# EAGLE design Mailchecker2 (EAGLE 6.1)
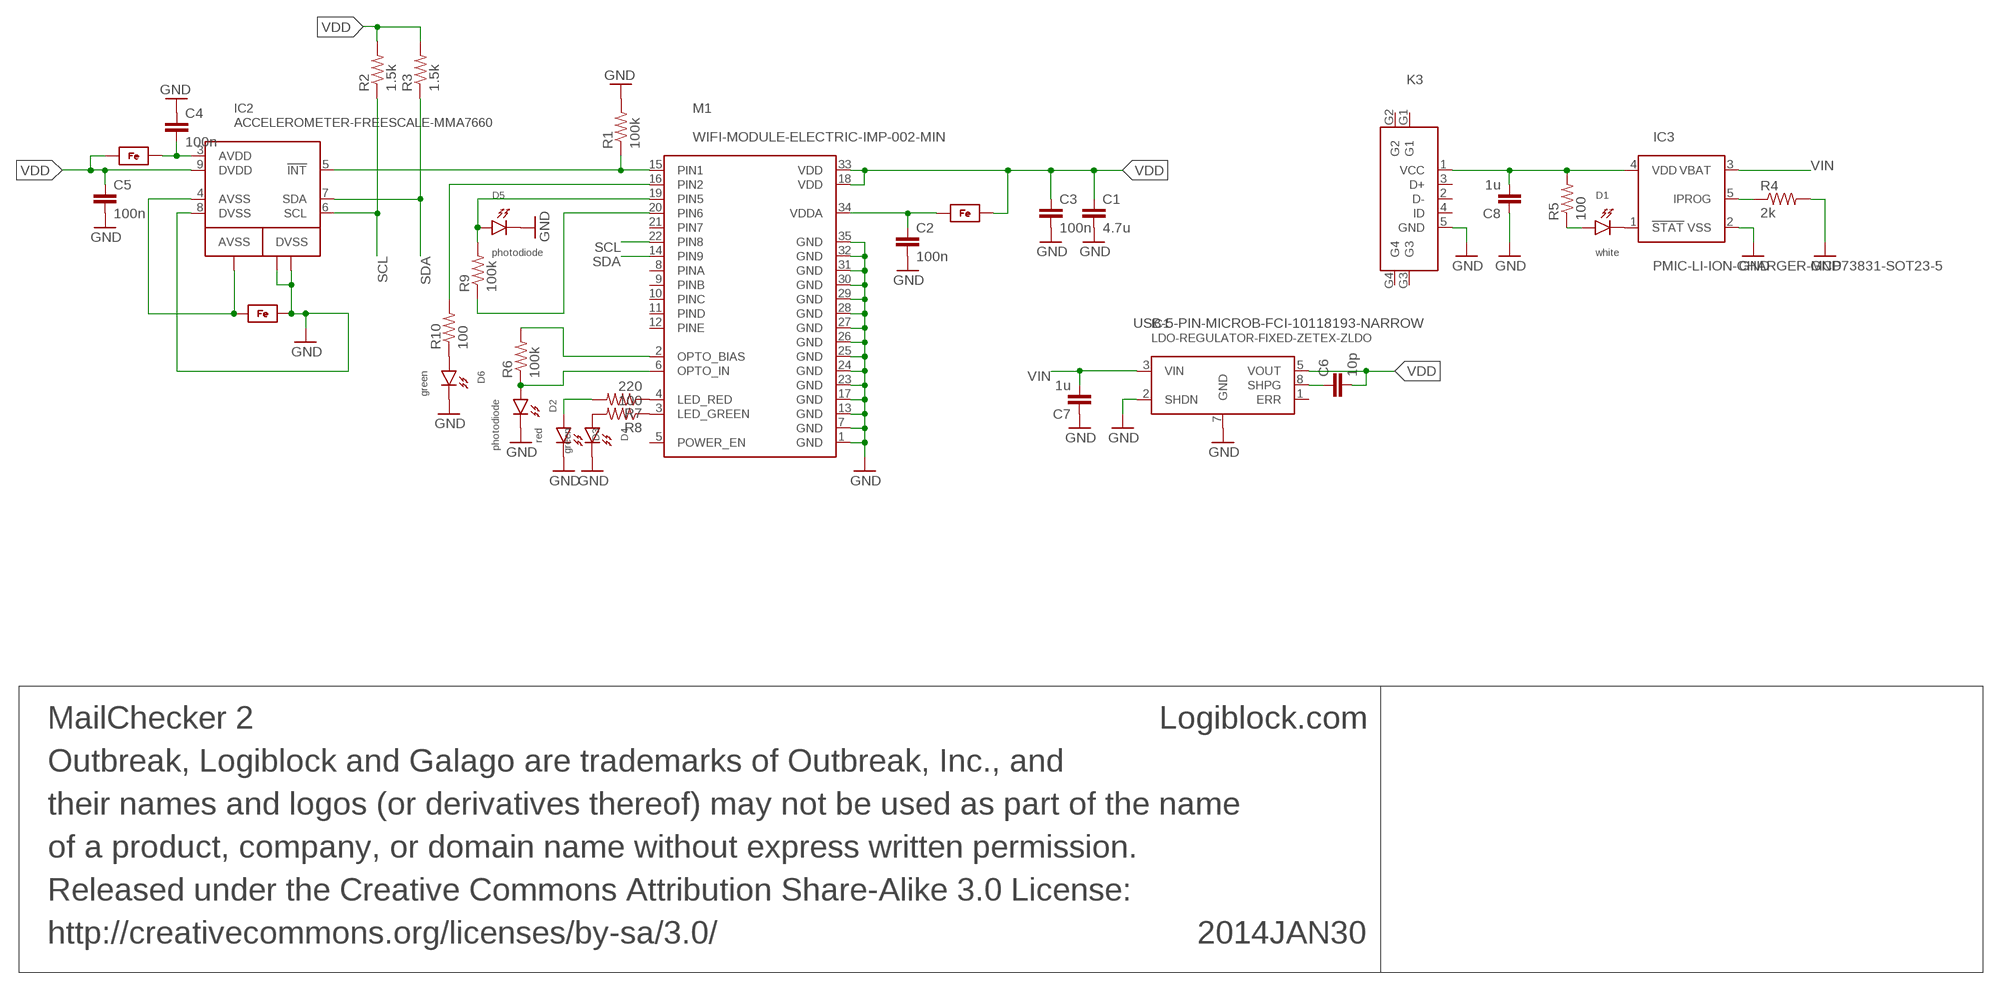
[diagram p0: schematic, sheet 1]

## Parts
2014JAN30  MailChecker 2  INFO-BLOCK  [INFO-BLOCK]
C1  4.7u  CAP-0805-MIN  [0805-MIN]
C2  100n  CAP-0402-MIN  [0402-MIN]
C3  100n  CAP-0402-MIN  [0402-MIN]
C4  100n  CAP-0402-MIN  [0402-MIN]
C5  100n  CAP-0402-MIN  [0402-MIN]
C6  10p  CAP-0402-MIN  [0402-MIN]
C7  1u  CAP-0603-MIN  [0603-MIN]
C8  1u  CAP-0603-MIN  [0603-MIN]
D1  white  LED-0603-MIN  [0603-DIODE-MIN]
D2  photodiode  LED-0603-MIN  [0603-DIODE-MIN]
D3  red  LED-0603-MIN  [0603-DIODE-MIN]
D4  green  LED-0603-MIN  [0603-DIODE-MIN]
D5  photodiode  LED-0603-MIN  [0603-DIODE-MIN]
D6  green  LED-0603-MIN  [0603-DIODE-MIN]
FB1  FERRITE-BEAD-0603-MIN  [0603-MIN]
FB2  FERRITE-BEAD-0603-MIN  [0603-MIN]
FB3  FERRITE-BEAD-0603-MIN  [0603-MIN]
IC1  LDO-REGULATOR-FIXED-ZETEX-ZLDO  [SM8-ZETEX]
IC2  ACCELEROMETER-FREESCALE-MMA7660  [QFN10-3X3MM-FREESCALE-MMA7660]
IC3  PMIC-LI-ION-CHARGER-MCP73831-SOT23-5  [SOT23-5]
K3  USB-5-PIN-MICROB-FCI-10118193-NARROW  [USB-MICROB-FCI-10118193-NARROW]
M1  WIFI-MODULE-ELECTRIC-IMP-002-MIN  [ELECTRIC-IMP-002-MIN]
R1  100k  RESISTOR-0402-MIN  [0402-MIN]
R2  1.5k  RESISTOR-0402-MIN  [0402-MIN]
R3  1.5k  RESISTOR-0402-MIN  [0402-MIN]
R4  2k  RESISTOR-0402-MIN  [0402-MIN]
R5  100  RESISTOR-0402-MIN  [0402-MIN]
R6  100k  RESISTOR-0402-MIN  [0402-MIN]
R7  220  RESISTOR-0402-MIN  [0402-MIN]
R8  100  RESISTOR-0402-MIN  [0402-MIN]
R9  100k  RESISTOR-0402-MIN  [0402-MIN]
R10  100  RESISTOR-0402-MIN  [0402-MIN]

## Nets
AVDD: C4.1 FB3.2 IC2.3(AVDD)
AVSS: FB2.1 IC2.1(G3) IC2.4(AVSS)
GND: C1.1 C2.1 C3.1 C4.2 C5.1 C7.2 C8.2 D2.K D3.K D4.K D5.K D6.K FB2.2 IC1.2(SHDN) IC1.7(GND) IC2.8(DVSS) IC2.G1 IC2.G2 IC3.2(VSS) K3.5(GND) M1.1(GND) M1.7(GND) M1.13(GND) M1.17(GND) M1.23(GND) M1.24(GND) M1.25(GND) M1.26(GND) M1.27(GND) M1.28(GND) M1.29(GND) M1.30(GND) M1.31(GND) M1.32(GND) M1.35(GND) R1.2 R4.2
INT: IC2.5(!INT) M1.15(PIN1) R1.1
IPROG: IC3.5(IPROG) R4.1
N$1: M1.2(OPTO_BIAS) R6.2
N$2: M1.20(PIN6) R9.1
N$3: D1.K IC3.1(!STAT)
N$4: D1.A R5.1
N$5: D2.A M1.6(OPTO_IN) R6.1
N$6: M1.4(LED_RED) R7.1
N$7: M1.3(LED_GREEN) R8.1
N$8: D4.A R8.2
N$9: D3.A R7.2
N$10: D5.A M1.19(PIN5) R9.2
N$11: M1.16(PIN2) R10.2
N$12: D6.A R10.1
SCL: IC2.6(SCL) M1.22(PIN8) R2.1
SDA: IC2.7(SDA) M1.14(PIN9) R3.1
SHAPING: C6.2 IC1.8(SHPG)
VCHARGE: C8.1 IC3.4(VDD) K3.1(VCC) R5.2
VDD: C1.2 C3.2 C5.2 C6.1 FB1.2 FB3.1 IC1.5(VOUT) IC2.9(DVDD) M1.18(VDD) M1.33(VDD) R2.2 R3.2
VDDA: C2.2 FB1.1 M1.34(VDDA)
VIN: C7.1 IC1.3(VIN) IC3.3(VBAT)
Unconnected: IC1.1(ERR) K3.2(D-) K3.3(D+) K3.4(ID) K3.G1 K3.G2 K3.G3 K3.G4 M1.5(POWER_EN) M1.8(PINA) M1.9(PINB) M1.10(PINC) M1.11(PIND) M1.12(PINE) M1.21(PIN7)

## Library data of the parts
2014JAN30 = Outbreak:INFO-BLOCK
C1-C8 = Outbreak:CAP
D1-D6 = Outbreak:LED
FB1-FB3 = Outbreak:FERRITE-BEAD
IC1 = Outbreak:LDO-REGULATOR-FIXED-ZETEX-ZLDO: ZETEX ULTRA LOW DROPOUT REGULATOR Ultra-low-dropout linear regulator Vin = [0V, 20V], Vout = 3.3V; Vin - 100mV when 0V < Vin < 3.4V Imax = 300mA continuous The shutdown pin (2, 'SHDN') is an active-high logic-level input: 0 - regulator active 1 - shutdown If not used, tie to GND The low battery flag (1, ERR) is an open-collector NPN driver which pulls low when the voltage drop across the regulator has fallen to less than 300mV. Not useful for very-low-dropout scenarios but can provide advance warning of battery failure for e.g. LiIon-to-3.3V use cases. Leave floating if not used. Pin 4 is internally N/C and my be connected in any fashion. Pin 6 is DNC and must be left floating.
IC2 = Outbreak:ACCELEROMETER-FREESCALE-MMA7660
IC3 = Outbreak:PMIC-LI-ION-CHARGER-MCP73831
K3 = Outbreak:USB-5-PIN
M1 = Outbreak:WIFI-MODULE-ELECTRIC-IMP-002
R1-R10 = Outbreak:RESISTOR: Resistor Basic schematic elements and footprints for 0603, 1206, and PTH resistors.

## Board
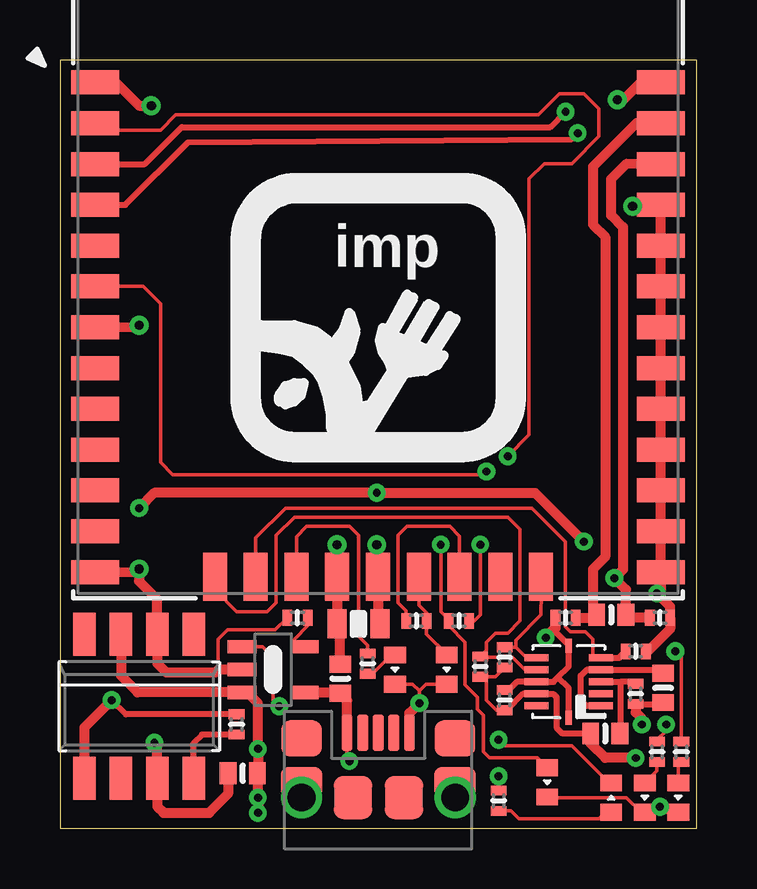
[diagram p1: board, top side]
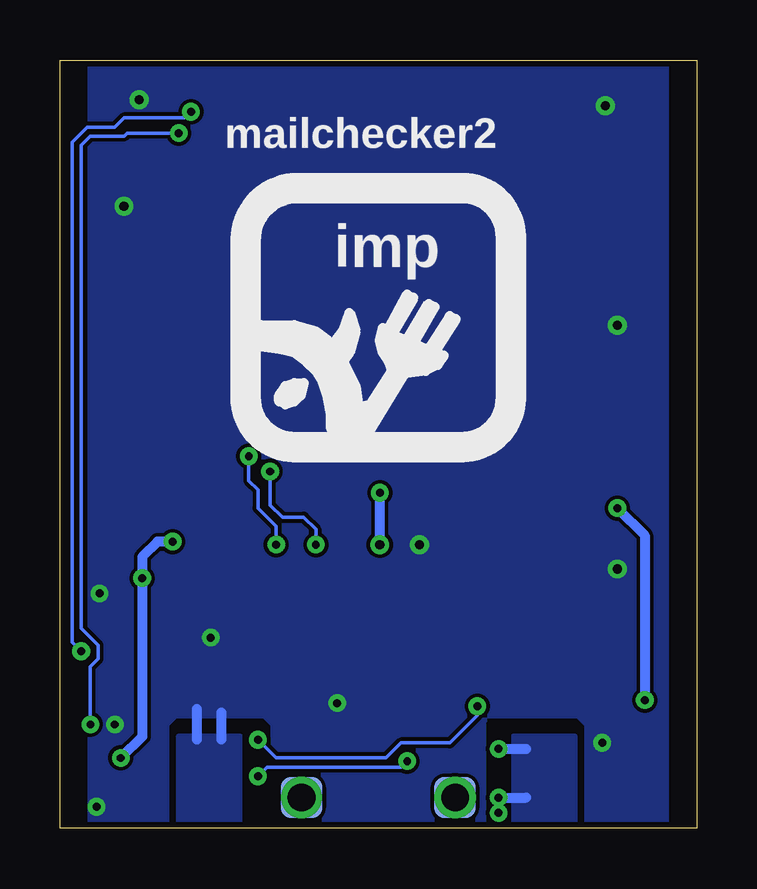
[diagram p2: board, bottom side, seen from below]

Size 26.54 x 32 mm. Coordinates in mm from the lower left corner, seen from the top.
Outline: 0,0 26.54,0 26.54,32 0,32 0,0
Copper layers (1*16): Top 0.035mm / dielectric 1.5mm / Bottom 0.035mm
Design rules: minimum track width 6mil, minimum drill 13mil, track to track 6mil, track to pad 6mil, pad to pad 6mil, via to via 6mil, smd to smd 6mil, copper to edge 10mil, drill to drill 8mil, minimum pad ring 10mil, minimum via ring 8mil, stop-mask expansion 4mil, vias tented up to drill 20mil, thermal gap 10mil

### Footprints (pad centres in the part's own frame; a part is rotated, then mirrored left to right if it is on the bottom)
0805-MIN = smd 0.8 x 1.2: 1 -0.9,0; 2 0.9,0
0402-MIN = smd 0.4 x 0.65: 1 -0.425,0; 2 0.425,0
0603-MIN = smd 0.7 x 0.9: 1 -0.61,0; 2 0.61,0
0603-DIODE-MIN = smd 0.7 x 0.9: A -0.61,0; K 0.61,0
SM8-ZETEX = smd 0.95 x 1.8: 1 2.28,3; 2 0.76,3; 3 -0.76,3; 4 -2.28,3; 5 -2.28,-3; 6 -0.76,-3; 7 0.76,-3; 8 2.28,-3
QFN10-3X3MM-FREESCALE-MMA7660 = smd 0.29 x 1: 1 1,1.35; 2 0.5,1.35; 3 0,1.35; 4 -0.5,1.35; 5 -1,1.35; 6 -1,-1.35; 7 -0.5,-1.35; 8 0,-1.35; 9 0.5,-1.35; 10 1,-1.35 | smd 0.6 x 0.29: G1 -1.5,0; G2 1.5,0
SOT23-5 = smd 0.55 x 1.2: 1 0.95,1.3; 2 0,1.3; 3 -0.95,1.3; 4 -0.95,-1.3; 5 0.95,-1.3
USB-MICROB-FCI-10118193-NARROW = smd 0.44 x 1.5: 1 -1.3,2.7; 2 -0.65,2.7; 3 0,2.7; 4 0.65,2.7; 5 1.3,2.7 | smd 1.7 x 1.5: G1 -3.2,2.473; G4 3.2,2.473 | smd 1.6 x 1.8: G2 -1.055,0; G3 1.075,0 | smd 1.72 x 1.72 bottom: G5 -3.2,0; G7 3.2,0 | smd 1.72 x 1.3: G6 -3.2,0.635; G8 3.2,0.635 | drill 1.15 pad 1.7: P$1 -3.2,0; P$2 3.2,0
ELECTRIC-IMP-002-MIN = smd 2 x 1: 1 0.7,21.29; 2 0.7,19.59; 3 0.7,17.89; 4 0.7,16.19; 5 0.7,14.49; 6 0.7,12.79; 7 0.7,11.09; 8 0.7,9.39; 9 0.7,7.69; 10 0.7,5.99; 11 0.7,4.29; 12 0.7,2.59; 13 0.7,0.89; 23 24.3,0.89; 24 24.3,2.59; 25 24.3,4.29; 26 24.3,5.99; 27 24.3,7.69; 28 24.3,9.39; 29 24.3,11.09; 30 24.3,12.79; 31 24.3,14.49; 32 24.3,16.19; 33 24.3,17.89; 34 24.3,19.59; 35 24.3,21.29 | smd 1 x 2: 14 5.7,0.69; 15 7.4,0.69; 16 9.1,0.69; 17 10.8,0.69; 18 12.5,0.69; 19 14.2,0.69; 20 15.9,0.69; 21 17.6,0.69; 22 19.3,0.69

### Placement (x,y rotation side)
2014JAN30  -7.62,-17.78 0 top  (outside the outline)
C1  12.45,8.51 0 top
C2  21.08,8.76 0 top
C3  25.02,8.76 180 top
C4  24,5.59 270 top
C5  18.54,5.33 270 top
C6  7.37,4.32 270 top
C7  7.62,2.29 180 top
C8  11.68,6.22 90 top
D1  22.99,1.27 90 top
D2  20.32,1.91 270 top
D3  24.38,1.27 270 top
D4  25.78,1.27 270 top
D5  16.13,6.6 270 top
D6  13.97,6.6 270 top
FB1  22.99,8.89 0 top
FB2  25.15,5.84 270 top
FB3  22.73,3.94 0 top
IC1  3.3,5.08 0 top
IC2  21.21,6.1 270 top
IC3  8.89,6.6 90 top
K3  13.27,1.27 0 top
M1  0.76,9.78 0 top
R1  24,7.37 0 top
R2  18.54,7.11 270 top
R3  17.53,6.73 270 top
R4  9.91,8.76 180 top
R5  18.29,1.14 90 top
R6  16.64,8.64 0 top
R7  24.89,3.17 270 top
R8  25.91,3.17 270 top
R9  14.86,8.64 0 top
R10  12.83,6.86 90 top

### Tracks (layer width: path | path; a pad name or v marks a point on that pad's centre or on a via)
AVDD
  Top 0.254: IC2.3 23.37,6.1 | C4.1 23.92,6.1 23.37,6.1 | 23.37,6.1 23.37,3.96 FB3.2
AVSS
  Top 0.254: FB2.1 25,6.6 IC2.4 21.96,6.6 21.72,6.35 21.72,5.33 21.95,5.1 IC2.1
GND  (via drill 0.33, 0.38)
  Top 0.152: D4.K 25.02,0.66 | 25.02,0.66 D3.K 24.51,0.64 24.26,0.64 23.62,1.27 20.32,1.27 D2.K | v25.02,0.89 25.02,0.66 | 6.6,6.6 6.6,7.87 6.99,8.26 8.97,8.26 R4.2 | D6.K 14.71,5.99 14.99,5.71 | v14.99,5.21 14.99,5.71 | D5.K 15.27,5.99 14.99,5.71
  Top 0.254: C4.2 25.08,5.16 FB2.2 | 20.77,6.29 20.57,6.1 IC2.8 19.05,6.1 18.71,5.76 C5.1 | 20.77,6.29 21.21,6.73 IC2.G1 21.21,7.62 20.57,8.26 | IC2.G2 21.21,5.84 20.77,6.29
  Top 0.406: M1.7 3.23,20.88 v3.3,20.95 | M1.13 3.19,10.68 v3.3,10.79 3.3,10.29 4.06,9.53 IC1.2 4.06,6.86 4.45,6.48 6.48,6.48 6.6,6.6 IC3.2 | v23.88,25.91 23.95,25.98 M1.32 M1.31 M1.30 M1.29 M1.28 M1.27 M1.26 M1.25 M1.24 M1.23 25.06,9.95 v24.89,9.78 25.44,9.23 C3.1 25.44,8.3 24.43,7.28 R1.2 | v11.56,11.81 M1.17 11.56,8.53 C1.1 11.68,8.37 C8.2 | M1.1 2.32,31.08 3.3,30.1 v3.81,30.1 | M1.35 24.22,31.08 23.5,30.35 v23.24,30.35 | K3.5 14.57,4.79 v14.99,5.21 | C2.1 20.66,8.34 20.57,8.26 v20.26,7.94 | C4.2 24,4.83 24.26,4.57 v24.26,4.32 | v3.94,3.56 4.06,3.43 IC1.7 4.06,0.89 4.32,0.64 6.22,0.64 7.01,1.42 C7.2
  Bottom 0.406: 19.81,3.68 19.81,4.83 | 20.83,3.68 20.83,4.95
  pour Bottom (rank 2): 1.27,32 25.27,32 25.27,0 22.1,0 22.1,4.32 21.72,4.7 18.03,4.7 17.65,4.32 17.65,0 8.89,0 8.89,4.45 8.64,4.7 4.95,4.7 4.57,4.32 4.57,0 1.27,0
  pour Bottom: 19.05,0 19.05,3.81 21.59,3.81 21.59,0
INT
  Top 0.152: IC2.5 22.24,7.1 22.23,7.11 22.23,7.87 21.91,8.19 21.27,8.19 21.08,8.38 21.08,11.94 19.68,13.34 9.4,13.34 8.16,12.1 M1.15
  Top 0.254: IC2.5 23.31,7.1 R1.1
IPROG
  Top 0.152: R4.1 10.33,8.43 9.78,7.87 9.78,7.75 9.97,7.55 IC3.5
N$1  (via drill 0.33)
  Top 0.152: M1.2 1.75,29.37 2.03,29.08 4.19,29.08 4.83,29.72 19.94,29.72 20.83,30.61 21.84,30.61 22.48,29.97 22.48,28.83 21.34,27.69 20.19,27.69 19.56,27.05 19.56,16.38 v18.67,15.49 | R6.2 17.27,8.64 17.53,8.89 v17.53,11.81
  Bottom 0.152: v18.67,15.49 18.67,14.48 18.29,14.1 18.29,13.34 17.53,12.57 v17.53,11.81
N$2
  Top 0.152: M1.20 16.66,12.17 16.26,12.57 14.48,12.57 14.1,12.19 14.1,9.4 14.43,9.06 R9.1
N$3  (via drill 0.33)
  Top 0.152: IC3.1 8.45,7.55 8.89,7.11 8.89,5.33 v9.14,5.08 | v18.29,3.68 18.54,3.43 21.34,3.43 22.89,1.88 D1.K
  Bottom 0.152: v9.14,5.08 9.14,4.7 10.29,3.56 12.32,3.56 12.95,2.92 17.53,2.92 v18.29,3.68
N$4
  Top 0.152: D1.A 22.76,0.66 22.48,0.38 19.13,0.38 18.8,0.72 R5.1
N$5  (via drill 0.33)
  Top 0.152: v15.88,11.81 15.88,9.02 16.21,8.68 R6.1 16.21,8.43 16.89,7.75 16.89,5.97 17.4,5.46 17.4,4.95 17.65,4.7 17.65,3.17 17.91,2.92 19.91,2.92 D2.A | M1.6 3.47,22.57 4.19,21.84 4.19,15.24 4.7,14.73 17.65,14.73 v17.78,14.86
  Bottom 0.152: v17.78,14.86 17.78,13.46 17.27,12.95 16.38,12.95 15.88,12.45 v15.88,11.81
N$6  (via drill 0.33)
  Top 0.152: v25.27,4.32 25.27,4.06 24.89,3.68 R7.1
  Top 0.254: M1.4 2.73,25.97 5.33,28.57 21.34,28.7 v21.59,28.96
  Bottom 0.152: v21.59,28.96 23.75,28.96 23.88,28.83 25.27,28.83 25.65,28.45 25.65,8.32 24.96,7.62 24.96,7.05 25.27,6.73 v25.27,4.32
N$7  (via drill 0.33)
  Top 0.152: R8.1 25.91,7.11 v25.65,7.37
  Top 0.254: M1.3 3.54,27.67 5.08,29.21 20.45,29.21 v21.08,29.84
  Bottom 0.152: v21.08,29.84 21.34,29.59 23.88,29.59 24.26,29.21 25.4,29.21 26.04,28.57 26.04,7.75 v25.65,7.37
N$8
  Top 0.152: D4.A 25.78,2.62 R8.2
N$9
  Top 0.152: R7.2 24.89,2.39 D3.A
N$10
  Top 0.152: M1.19 14.96,9.29 15.28,8.97 R9.2 15.28,8.08 16.15,7.21 D5.A
N$11
  Top 0.152: M1.16 9.86,12.15 10.29,12.57 12.06,12.57 12.45,12.19 12.45,8 12.83,7.62 R10.2
N$12
  Top 0.152: R10.1 13.04,6.43 13.82,7.21 D6.A
SCL
  Top 0.152: 19.01,7.54 19.45,7.1 IC2.6 20.18,7.1 | R2.1 19.01,7.54 | 19.01,7.54 19.01,7.83 20.06,8.89 20.06,9.27 20.07,9.4 M1.22
SDA
  Top 0.152: IC2.7 19.38,6.6 18.86,7.11 17.57,7.11 R3.1 17.78,7.41 17.78,7.75 18.16,8.13 18.67,8.13 19.18,8.64 19.18,12.45 18.67,12.95 9.78,12.95 9.02,12.19 9.02,9.4 8.64,9.02 7.37,9.02 6.46,9.92 M1.14
SHAPING
  Top 0.254: C6.2 5.92,3.89 5.58,3.55 IC1.8
VCHARGE  (via drill 0.33)
  Top 0.152: K3.1 11.97,2.89 v12.06,2.79 | R5.2 v18.29,2.16
  Top 0.406: K3.1 11.97,5.33 C8.1 11.64,5.65 IC3.4
  Bottom 0.152: v12.06,2.79 12.32,2.54 17.91,2.54 v18.29,2.16
VDD  (via drill 0.33, 0.38)
  Top 0.152: C5.2 18.2,4.91 17.78,5.33 17.78,6.1 17.57,6.31 R3.2 18.16,6.31 R2.2
  Top 0.254: C5.2 18.62,4.91 19.31,5.6 IC2.9 20.57,5.6 20.7,5.46 20.7,4.19 20.95,3.94 FB3.1 | C6.1 2.75,4.74 v2.16,5.33
  Top 0.406: M1.33 23.61,27.68 22.99,27.05 22.99,25.53 23.47,25.04 23.47,10.77 v23.11,10.41 23.6,9.93 FB1.2 23.72,8.76 C3.2 | C1.2 13.26,8.59 M1.18 13.26,10.49 13.21,10.54 v13.21,11.81 | FB3.1 22.12,3.53 22.73,2.92 v24,2.92 | v3.3,13.34 3.94,13.97 v13.21,13.97 19.81,13.97 v21.84,11.94 | IC1.5 1.02,4.2 v2.16,5.33
  Bottom 0.406: v24,2.92 23.11,3.81 v23.11,10.41 23.11,11.3 22.48,11.94 v21.84,11.94 | v13.21,11.81 v13.21,13.97 | v3.3,13.34 2.16,12.19 v2.16,5.33
VDDA
  Top 0.406: M1.34 24.05,29.38 22.23,27.56 22.23,25.15 22.73,24.64 22.73,11.3 22.23,10.79 22.23,9.04 FB1.1 22.25,8.76 C2.2
VIN  (via drill 0.33)
  Top 0.406: IC1.3 2.54,6.35 3.24,5.65 IC3.3 7.81,5.65 8.23,5.23 8.23,3.33 v8.26,3.3 8.26,2.31 C7.1 8.23,1.29 v8.26,1.27 v8.26,0.64
  Bottom 0.406: v8.26,3.3 7.11,3.3 | v8.26,1.27 7.11,1.27
  pour Bottom: 5.08,0 5.08,3.81 7.62,3.81 7.62,0

### Text on the board
tPlace: imp
bPlace: mailchecker2 | imp